# EasyEDA Pro project ProPrj_两相交错电源demo_2025-05-26.epro, board PCB5_1
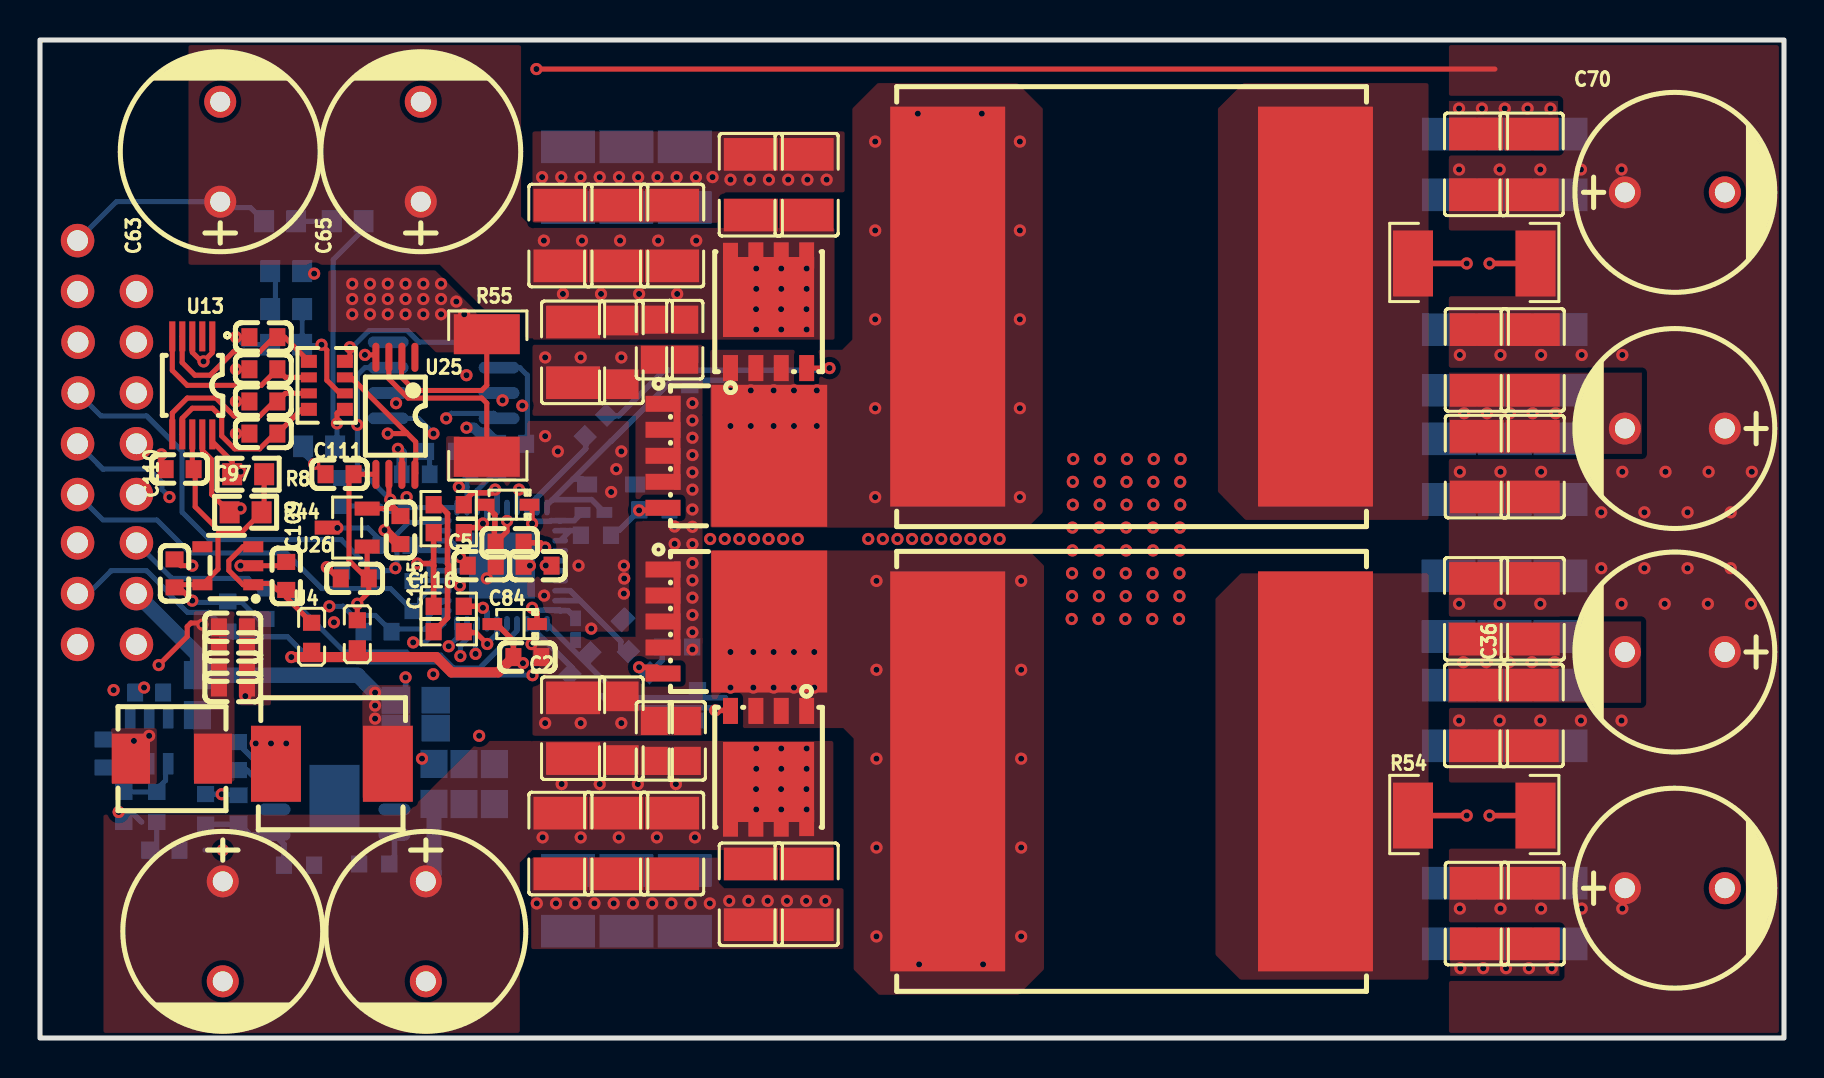
[diagram p7: board, top side]
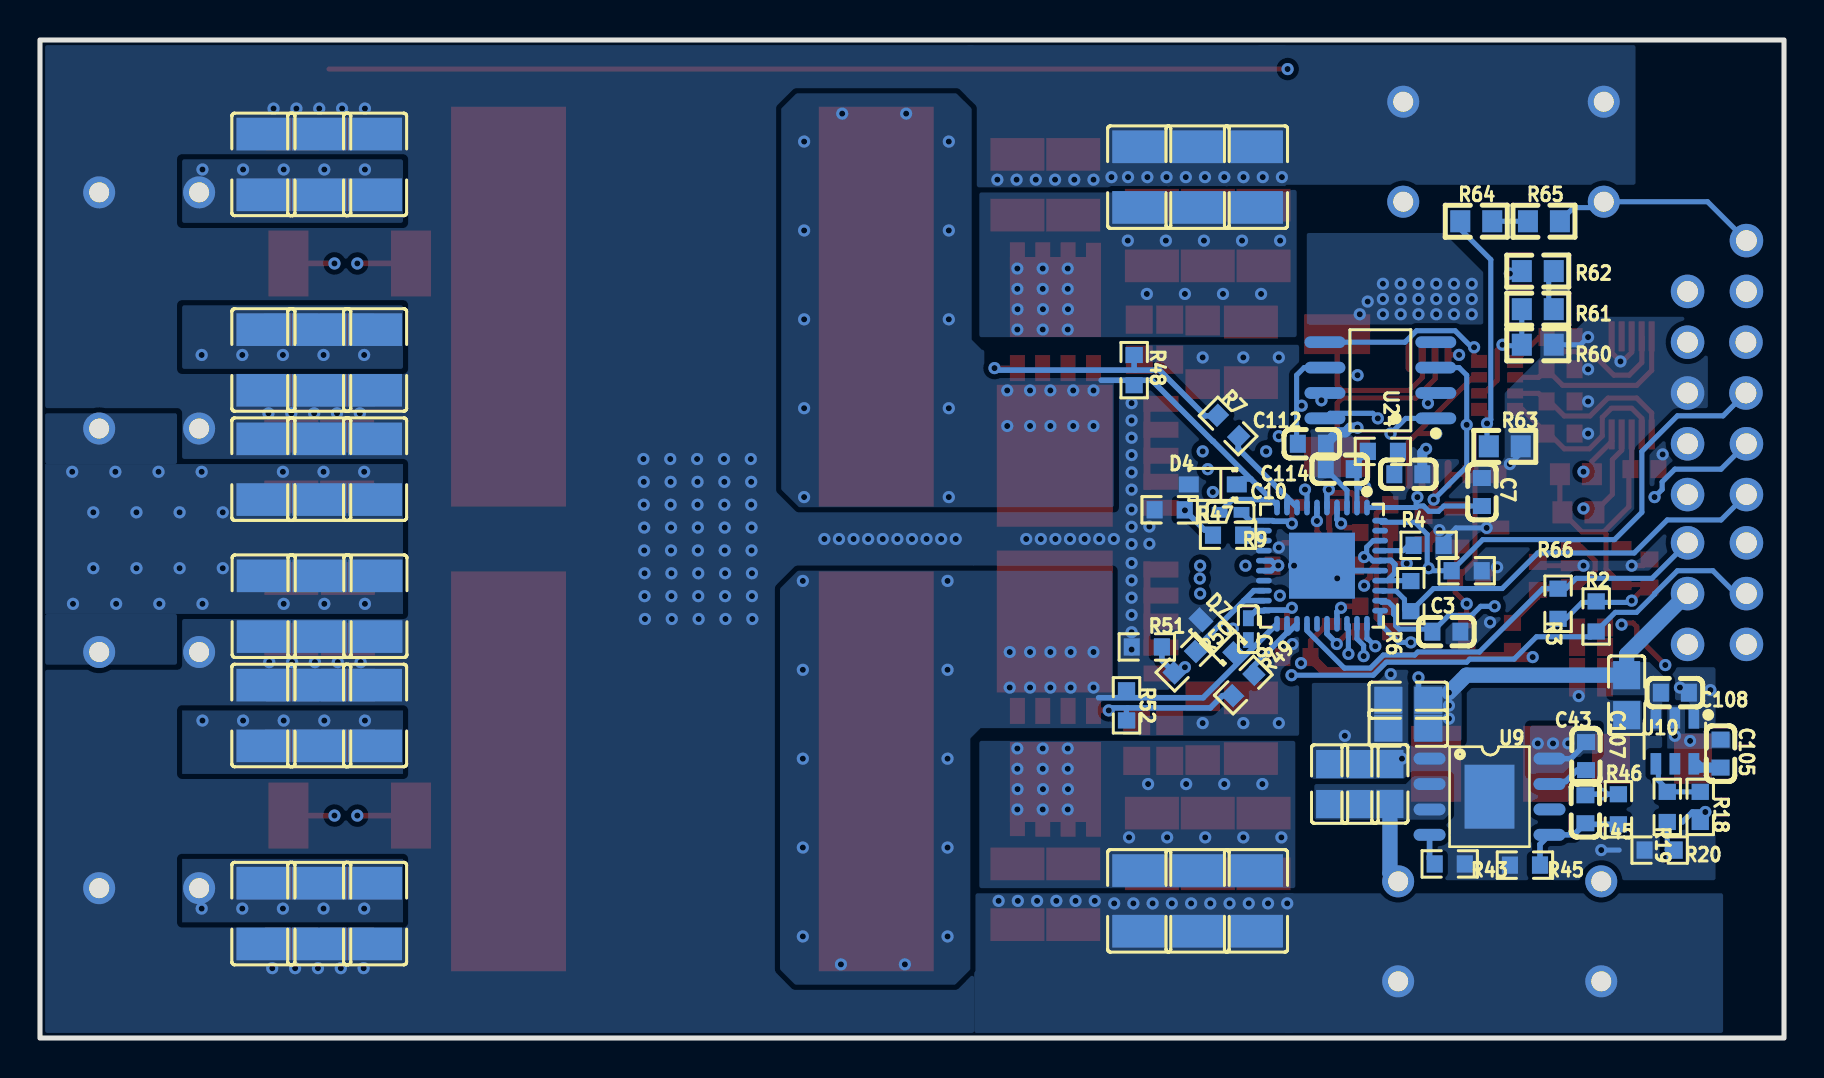
[diagram p8: board, bottom side, seen from below]

Outline 87.25 x 49.91 mm; copper layers: Top Layer, Inner1, Inner2, Bottom Layer. Coordinates in mm from the lower left corner of the outline.
Outline path: rectangle 0,49.91 87.25,0
Stack: Top Layer 0.035mm 外层铜厚1oz / Dielectric1 0.2104mm 7628 RC49% 8.6mil / Inner1 0.0152mm 内层铜厚 / Dielectric2 1.065mm 1.1mm H/HOZ Copper / Inner2 0.0152mm 内层铜厚 / Dielectric3 0.2104mm 7628 RC49% 8.6mil / Bottom Layer 0.035mm 外层铜厚1oz

## Design rules (mm)
template: 自定义配置
spacing copperThickness1oz (default): track to track 0.102, other pairs 0.152 to 0.3
spacing copperThickness2oz: track to track 0.203, other pairs 0.152 to 0.3
track width copperThickness1oz (default): min 0.127, default 0.254, max 2.54
track width copperThickness2oz: min 0.203, default 0.254, max 2.54
differential pair differentialPair (default): width min 0.127, default 0.254, max 2.54; gap min 0.152, default 0.152
via viaSize (default): diameter min 0.5, default 0.61, max 10; hole min 0.3, default 0.305, max 6.3

## Placement (name value [footprint] x y rotation side)
C2  1uF  [C0603]  24.38 19.05 0 top
C3  1uF  [C0603]  16.89 20.32 180 bottom
C5  1uF  [C0603]  22.1 23.62 0 top
C7  1uF  [C0603]  15.11 27.3 90 bottom
C8  220nF  [C0402]  26.8 20.45 270 bottom
C9  100nF  [C1210]  29.34 6.86 90 bottom
C10  220nF  [C0402]  27.69 26.29 180 bottom
C11  1uF  [C0603]  24.89 23.62 0 top
C14  100nF  [C1210]  26.03 40.13 270 top
C15  22uF  [C0805]  18.8 16.89 180 bottom
C16  22uF  [C0805]  18.8 15.49 180 bottom
C17  100nF  [C1206]  29.08 34.29 90 top
C19  100nF  [C1210]  32.26 43.05 270 bottom
C20  100nF  [C1210]  28.83 40.13 270 top
C21  100nF  [C1210]  31.62 40.13 270 top
C22  100nF  [C1210]  26.67 34.29 90 top
C29  100nF  [C1210]  71.84 21.46 90 top
C30  100nF  [C1210]  71.88 6.22 90 top
C31  100nF  [C1210]  74.68 6.22 90 top
C32  100nF  [C1210]  70.49 43.69 270 bottom
C33  100nF  [C1210]  71.84 43.69 270 top
C34  100nF  [C1210]  71.84 16.13 270 top
C35  100nF  [C1210]  74.62 16.13 270 top
C36  100nF  [C1210]  74.68 21.46 90 top
C37  100nF  [C1210]  74.62 43.69 270 top
C38  100nF  [C1210]  74.68 28.58 270 top
C41  2.2uF  [C0805]  19.72 12.71 90 bottom
C43  2.2nF  [C0603]  9.91 14.1 90 bottom
C45  56pF  [C0603]  9.94 11.44 90 bottom
C49  2.2uF  [C0805]  32.26 34.92 90 top
C50  2.2uF  [C0805]  30.73 34.92 90 top
C51  2.2uF  [C0805]  30.73 14.86 270 top
C52  2.2uF  [C0805]  32.39 14.86 270 top
C56  100nF  [C1210]  35.56 42.67 270 top
C57  100nF  [C1210]  26.42 43.05 270 bottom
C58  100nF  [C1210]  38.35 42.67 270 top
C59  100nF  [C1210]  26.42 6.86 90 bottom
C60  100nF  [C1210]  32.26 6.86 90 bottom
C61  100nF  [C1210]  29.34 43.05 270 bottom
C62  100nF  [C1206]  29.08 15.49 270 top
C63  100uF  [CAP-TH_BD10.0-P5.00-D0.6-FD_2]  9.02 44.32 90 top
C65  100uF  [CAP-TH_BD10.0-P5.00-D0.6-FD_2]  19.05 44.32 90 top
C66  100uF  [CAP-TH_BD10.0-P5.00-D0.6-FD_2]  81.79 7.49 0 top
C67  100uF  [CAP-TH_BD10.0-P5.00-D0.6-FD_2]  19.3 5.33 270 top
C68  100uF  [CAP-TH_BD10.0-P5.00-D0.6-FD_2]  81.79 19.3 180 top
C69  100uF  [CAP-TH_BD10.0-P5.00-D0.6-FD_2]  81.79 30.48 180 top
C70  100uF  [CAP-TH_BD10.0-P5.00-D0.6-FD_2]  81.79 42.29 0 top
C71  100uF  [CAP-TH_BD10.0-P5.00-D0.6-FD_2]  9.14 5.33 270 top
C72  100nF  [C1210]  35.56 7.19 90 top
C73  100nF  [C1210]  38.35 7.19 90 top
C74  100nF  [C1210]  31.62 9.73 90 top
C75  100nF  [C1210]  28.83 9.73 90 top
C76  100nF  [C1210]  26.03 9.73 90 top
C77  100nF  [C1210]  26.67 15.49 270 top
C81  100nF  [C1210]  71.88 28.58 270 top
C82  100nF  [C1210]  71.88 33.91 90 top
C83  100nF  [C1210]  74.68 33.91 90 top
C84  1uF  [C0603]  23.5 24.77 0 top
C95  105/25V  [C0603#2]  11.18 30.23 0 top
C96  105/25V  [C0603#2]  11.18 31.83 0 top
C97  105/25V  [C0603#2]  6.99 28.45 0 top
C98  105/25V  [C0603#2]  11.18 35.05 0 top
C99  105/25V  [C0603#2]  11.18 33.44 0 top
C102  2.2uF  [C0805]  21.21 12.7 90 bottom
C103  2.2uF  [C0805]  22.73 12.7 90 bottom
C104  22uF  [C0603]  9.65 17.53 0 top
C105  100nF  [C0603]  3.18 14.22 270 bottom
C106  22uF  [C0603]  9.65 18.54 0 top
C107  22uF  [C0805]  7.87 17.14 270 bottom
C108  4.7uF  [C0603]  5.46 17.27 180 bottom
C109  10uF  [C0603]  12.32 23.11 90 top
C110  10uF  [C0603]  6.73 23.24 270 top
C111  1uF  [C0603]  14.99 28.19 0 top
C112  1uF  [C0603]  23.62 29.72 180 bottom
C113  1uF  [C0603]  18.8 28.19 0 bottom
C114  1uF  [C0603]  22.22 28.45 180 bottom
C115  22uF  [C0603]  18.03 25.4 270 top
C116  4.7uf  [C0603]  15.75 22.99 0 top
C119  22uF  [C0603]  9.65 20.54 0 top
C120  22uF  [C0603]  9.65 19.56 0 top
C121  100nF  [C1210]  73.28 43.69 270 bottom
C122  100nF  [C1210]  76.07 43.69 270 bottom
C123  100nF  [C1210]  70.49 16.13 270 bottom
C124  100nF  [C1210]  73.28 16.13 270 bottom
C125  100nF  [C1210]  76.07 16.13 270 bottom
C126  100nF  [C1210]  76.07 33.91 90 bottom
C127  100nF  [C1210]  73.28 33.91 90 bottom
C128  100nF  [C1210]  70.49 33.91 90 bottom
C129  100nF  [C1210]  70.49 6.22 90 bottom
C129#2  -  [C1210]  70.47 21.59 90 bottom
C130  100nF  [C1210]  76.06 21.59 90 bottom
C130#2  -  [C1210]  73.26 21.59 90 bottom
C131  100nF  [C1210]  76.07 6.22 90 bottom
C132  100nF  [C1210]  73.28 6.22 90 bottom
C133  100nF  [C1210]  76.07 28.45 270 bottom
C134  100nF  [C1210]  73.28 28.45 270 bottom
C135  100nF  [C1210]  70.49 28.45 270 bottom
D4  BAS316,115  [SOD-323_L1.8-W1.3-LS2.5-FD]  28.58 27.69 180 bottom
D5  PMEG6010CEJ  [SOD-323_L1.7-W1.3-LS2.5-RD-1]  23.75 20.7 180 top
D6  PMEG6010CEJ  [SOD-323_L1.7-W1.3-LS2.5-RD-1]  23.37 26.67 180 top
D7  BAS316,115  [SOD-323_L1.8-W1.3-LS2.5-FD]  28.32 20.07 225 bottom
L1  68uH  [IND-SMD_L7.1-W6.6-1]  14.61 13.72 0 top
L2  10uH  [IND-SMD_L5.4-W5.2_FXL0530]  6.6 13.97 0 top
NOREF  -  [Pad_e2173]  4.83 32.26 0 top
NOREF#2  -  [Pad_e2176]  4.83 24.77 0 top
NOREF#3  -  [Pad_e2203]  1.91 32.26 0 top
NOREF#4  -  [Pad_e3434]  1.88 39.88 0 top
NOREF#5  -  [Pad_e2204]  1.88 29.72 0 top
NOREF#6  -  [Pad_e2202]  1.91 34.8 0 top
NOREF#7  -  [Pad_e2206]  1.88 24.77 0 top
NOREF#8  -  [Pad_e2192]  4.83 37.34 0 top
NOREF#9  -  [Pad_e2177]  4.83 22.22 0 top
NOREF#10  -  [Pad_e2205]  1.88 27.18 0 top
NOREF#11  -  [Pad_e2207]  1.88 22.22 0 top
NOREF#12  -  [Pad_e2174]  4.83 29.72 0 top
NOREF#13  -  [Pad_e2175]  4.83 27.18 0 top
NOREF#14  -  [Pad_e2172]  4.83 34.8 0 top
NOREF#15  -  [Pad_e2208]  1.88 19.69 0 top
NOREF#16  -  [Pad_e2201]  1.88 37.34 0 top
NOREF#17  -  [Pad_e2191]  4.83 19.69 0 top
Q10  BSC026N08NS5  [PG-TDSON-8_L5.0-W6.0-P1.27-BL-EP]  36.45 36.32 0 top
Q11  IAUA250N08S5N018AUMA1  [PG-HSOF-5_L6.9-W6.7-P1.30-LS8.0-BL]  33.83 29.12 270 top
Q12  BSC026N08NS5  [PG-TDSON-8_L5.0-W6.0-P1.27-BL-EP]  36.45 13.54 180 top
Q13  IAUA250N08S5N018AUMA1  [PG-HSOF-5_L6.9-W6.7-P1.30-LS8.0-BL]  33.83 20.83 270 top
R2  22kΩ  [R0603#2]  9.4 21.08 270 bottom
R3  22kΩ  [R0603#2]  11.3 21.72 90 bottom
R4  75kΩ  [R0603#2]  17.78 24.64 180 bottom
R6  10kΩ  [R0603#2]  18.67 22.1 90 bottom
R7  4.7Ω  [R0603#2]  27.81 30.61 45 bottom
R8  5.1K  [R0603]  10.41 28.19 0 top
R9  4.7Ω  [R0603#2]  27.81 25.15 0 bottom
R18  100K  [R0603#2]  4.19 11.56 270 bottom
R19  12K  [R0603#2]  5.84 11.56 90 bottom
R20  1.5K  [R0603#2]  6.22 9.4 180 bottom
R43  100kΩ  [R0603#2]  16.72 8.71 0 bottom
R44  5.1K  [R0603]  10.29 26.29 0 top
R45  43kΩ  [R0603#2]  12.96 8.65 180 bottom
R46  390kΩ  [R0603#2]  8.29 11.44 90 bottom
R47  100kΩ  [R0603#2]  30.73 26.42 0 bottom
R48  100kΩ  [R0603#2]  32.51 33.4 270 bottom
R49  4.7Ω  [R0603#2]  27.05 17.65 315 bottom
R50  4.7Ω  [R0603#2]  29.97 18.8 315 bottom
R51  100kΩ  [R0603#2]  31.88 19.56 0 bottom
R52  100kΩ  [R0603#2]  32.89 16.64 90 bottom
R53  10mΩ  [RES-SMD_L6.4-W3.2-R2512]  71.75 38.73 0 top
R54  10mΩ  [RES-SMD_L6.4-W3.2-R2512]  71.75 11.12 0 top
R55  10mΩ  [RES-SMD_L6.4-W3.2-R2512]  22.35 32.13 270 top
R56  47Ω  [R0603#2]  20.45 21.59 0 top
R57  47Ω  [R0603#2]  20.45 26.67 0 top
R58  47Ω  [R0603#2]  20.45 20.32 0 top
R59  47Ω  [R0603#2]  20.45 25.27 0 top
R60  2K/0.1%  [R0603]  12.32 34.67 0 bottom
R61  20K/0.1%  [R0603]  12.32 36.45 180 bottom
R62  20K/0.1%  [R0603]  12.32 38.35 0 bottom
R63  2K/0.1%  [R0603]  13.97 29.59 0 bottom
R64  20K/0.1%  [R0603]  15.4 40.85 180 bottom
R65  20K/0.1%  [R0603]  12.01 40.85 180 bottom
R66  100k  [R0603#2]  15.88 23.37 0 bottom
R67  10kΩ  [R0603#2]  20.07 29.34 180 bottom
RN2  5.1K  [RES-ARRAY-SMD_0603-8P-L3.2-W1.6-BL]  14.35 32.64 90 top
U4  -  [SOT-23-5_L3.0-W1.7-P0.95-LS2.8-TL]  9.4 23.62 180 top
U9  -  [SO-8_L4.9-W3.9-P1.27-LS6.0-BL-EP]  14.73 12.07 270 bottom
U10  TPS54302DDCR  [SOT-23-6_L2.9-W1.6-P0.95-LS2.8-BL]  5.46 14.86 0 bottom
U13  SGM58031  [MSOP-10_L3.0-W3.0-P0.50-LS5.0-BR]  7.62 32.64 90 top
U19  LM5143QRWGRQ1  [VQFN-40_L6.0-W6.0-P0.50-TL-EP3.3]  23.11 23.62 270 bottom
U22  4.7uH  [IND-SMD_L23.5-W22.0]  54.61 36.58 0 top
U23  4.7uH  [IND-SMD_L23.5-W22.0]  54.61 13.33 0 top
U24  INA240A2DR  [SOIC-8_L4.9-W3.9-P1.27-LS6.0-BL]  20.19 32.89 90 bottom
U25  INA240A1PWR  [TSSOP-8_L4.4-W3.0-P0.65-LS6.4-BL]  17.78 31.11 180 top
U26  REF3033AIDBZT  [SOT-23-3_L2.9-W1.3-P1.90-LS2.4-BR]  15.37 25.53 0 top
U27  磁珠60Ω±25%@100MHz/3A/0603  [L0603]  13.59 20.07 90 top
U28  磁珠60Ω±25%@100MHz/3A/0603  [L0603]  15.88 20.19 90 top

## Footprints (pads in the part's own frame, mm; a bottom-side part is the same pattern mirrored in y, then rotated)
C0402
  rect 0.79x0.54 smd: 1(-0.545,0) 2(0.545,0)
C0603
  rect 0.8x0.9 smd: 1(-0.7,0) 2(0.7,0)
C0603#2
  custom 0.8x0.9 smd: 1(-0.7,0) 2(0.7,0)
C0805
  rect 1.41x1.35 smd: 1(-1,0) 2(1,0)
C1206
  rect 1.485x1.728 smd: 1(-1.593,0) 2(1.593,0)
C1210
  rect 1.635x2.7 smd: 1(-1.518,0) 2(1.518,0)
CAP-TH_BD10.0-P5.00-D0.6-FD_2
  round 1.6 hole 1: 1(-2.5,0) 2(2.5,0)
IND-SMD_L5.4-W5.2_FXL0530
  rect 1.9x2.5 smd: 1(-2.05,0) 2(2.05,0)
IND-SMD_L7.1-W6.6-1
  rect 2.5x3.8 smd: 1(-2.8,0) 2(2.8,0)
IND-SMD_L23.5-W22.0
  rect 5.75x20 smd: 1(-9.2,0) 2(9.2,0)
L0603
  rect 0.8x0.864 smd: 1(-0.7,0) 2(0.7,0)
MSOP-10_L3.0-W3.0-P0.50-LS5.0-BR
  rect 1.5x0.305 smd: 1(2.451,-1) 2(2.451,-0.5) 3(2.451,0) 4(2.451,0.5) 5(2.451,1) 6(-2.451,1) 7(-2.451,0.5) 8(-2.451,0) 9(-2.451,-0.5) 10(-2.451,-1)
Pad_e2172
  round 1.677 hole 1.042: IIN(0,0)
Pad_e2173
  round 1.677 hole 1.042: 1(0,0)
Pad_e2174
  round 1.677 hole 1.042: 1(0,0)
Pad_e2175
  round 1.677 hole 1.042: 1(0,0)
Pad_e2176
  round 1.677 hole 1.042: 1(0,0)
Pad_e2177
  round 1.677 hole 1.042: 1(0,0)
Pad_e2191
  round 1.677 hole 1.042: 1(0,0)
Pad_e2192
  round 1.677 hole 1.042: 1(0,0)
Pad_e2201
  round 1.677 hole 1.042: 1(0,0)
Pad_e2202
  round 1.677 hole 1.042: 1(0,0)
Pad_e2203
  round 1.677 hole 1.042: 1(0,0)
Pad_e2204
  round 1.677 hole 1.042: 1(0,0)
Pad_e2205
  round 1.677 hole 1.042: 1(0,0)
Pad_e2206
  round 1.677 hole 1.042: 1(0,0)
Pad_e2207
  round 1.677 hole 1.042: 1(0,0)
Pad_e2208
  round 1.677 hole 1.042: 1(0,0)
Pad_e3434
  round 1.677 hole 1.042: 1(0,0)
PG-HSOF-5_L6.9-W6.7-P1.30-LS8.0-BL
  rect 0.8x1.75 smd: 1(-2.6,-2.658) 2(-1.3,-2.658) 3(0,-2.658) 4(1.3,-2.658) 5(2.6,-2.658)
  rect 4.7x0.35 smd: 1(-0.65,-1.958)
  rect 7.1x5.8 smd: 6(0,2.658)
PG-TDSON-8_L5.0-W6.0-P1.27-BL-EP
  rect 0.75x1.3 smd: 1(-1.905,-2.82) 2(-0.635,-2.82) 3(0.635,-2.82) 4(1.905,-2.82) 5(1.905,2.82) 6(0.635,2.82) 7(-0.635,2.82) 8(-1.905,2.794)
  rect 4.56x4 smd: 8(0,0.737)
R0603
  rect 1x1.1 smd: 1(-0.8,0) 2(0.8,0)
R0603#2
  rect 0.806x0.864 smd: 1(-0.753,0) 2(0.753,0)
RES-ARRAY-SMD_0603-8P-L3.2-W1.6-BL
  rect 0.65x0.8 smd: 1(-1.2,-0.9) 4(1.2,-0.9) 5(1.2,0.9) 8(-1.2,0.9)
  rect 0.5x0.8 smd: 2(-0.4,-0.9) 3(0.4,-0.9) 6(0.4,0.9) 7(-0.4,0.9)
RES-SMD_L6.4-W3.2-R2512
  rect 2x3.3 smd: 1(-3.067,0) 2(3.067,0)
SO-8_L4.9-W3.9-P1.27-LS6.0-BL-EP
  oval 0.6x1.6 smd: 1(-1.905,-2.999) 2(-0.635,-2.999) 3(0.635,-2.999) 4(1.905,-2.999) 5(1.905,2.999) 6(0.635,2.999) 7(-0.635,2.999) 8(-1.905,2.999)
  rect 3.2x2.499 smd: 9(0,0)
SOD-323_L1.7-W1.3-LS2.5-RD-1
  rect 0.985x0.6 smd: 1(-1.117,0) 2(1.117,0)
SOD-323_L1.8-W1.3-LS2.5-FD
  rect 1x0.8 smd: 1(-1.2,0) 2(1.2,0)
SOIC-8_L4.9-W3.9-P1.27-LS6.0-BL
  oval 0.588x2.045 smd: 1(-1.905,-2.772) 2(-0.635,-2.772) 3(0.635,-2.772) 4(1.905,-2.772) 5(1.905,2.772) 6(0.635,2.772) 7(-0.635,2.772) 8(-1.905,2.772)
SOT-23-3_L2.9-W1.3-P1.90-LS2.4-BR
  rect 1.25x0.7 smd: 1(1,-0.95) 2(1,0.95) 3(-1,0)
SOT-23-5_L3.0-W1.7-P0.95-LS2.8-TL
  rect 1.001x0.551 smd: 1(-1.272,0.95) 2(-1.272,0) 3(-1.272,-0.95) 4(1.272,-0.95) 5(1.272,0.95)
SOT-23-6_L2.9-W1.6-P0.95-LS2.8-BL
  rect 0.532x1.072 smd: 1(-0.95,-1.149) 2(0,-1.149) 3(0.95,-1.149) 4(0.95,1.149) 5(0,1.149) 6(-0.95,1.149)
TSSOP-8_L4.4-W3.0-P0.65-LS6.4-BL
  oval 0.353x1.454 smd: 1(-0.975,-2.927) 2(-0.325,-2.927) 3(0.325,-2.927) 4(0.975,-2.927) 5(0.975,2.927) 6(0.325,2.927) 7(-0.325,2.927) 8(-0.975,2.927)
VQFN-40_L6.0-W6.0-P0.50-TL-EP3.3
  oval 0.79x0.28 smd: 1(-2.908,2.25) 2(-2.908,1.75) 3(-2.908,1.25) 4(-2.908,0.75) 5(-2.908,0.25) 6(-2.908,-0.25) 7(-2.908,-0.75) 8(-2.908,-1.25) 9(-2.908,-1.75) 10(-2.908,-2.25) 21(2.908,-2.25) 22(2.908,-1.75) 23(2.908,-1.25) 24(2.908,-0.75) 25(2.908,-0.25) 26(2.908,0.25) 27(2.908,0.75) 28(2.908,1.25) 29(2.908,1.75) 30(2.908,2.25)
  oval 0.28x0.79 smd: 11(-2.25,-2.908) 12(-1.75,-2.908) 13(-1.25,-2.908) 14(-0.75,-2.908) 15(-0.25,-2.908) 16(0.25,-2.908) 17(0.75,-2.908) 18(1.25,-2.908) 19(1.75,-2.908) 20(2.25,-2.908) 31(2.25,2.908) 32(1.75,2.908) 33(1.25,2.908) 34(0.75,2.908) 35(0.25,2.908) 36(-0.25,2.908) 37(-0.75,2.908) 38(-1.25,2.908) 39(-1.75,2.908) 40(-2.25,2.908)
  rect 3.3x3.3 smd: 41(0,0)

## Nets
12V: C15.2 C16.2 C45.2 C107.1 C108.1 L1.2 NOREF#9.1 R46.2 U10.3
+3.3V: C97.2 C110.2 R2.1 R3.1 R8.2 R44.2 U4.5 U13.8
+5V: C2.1 C84.1 C104.1 C106.1 C109.1 C111.2 C112.1 C116.2 C119.1 C120.1 D5.2 D6.2 L2.2 NOREF#17.1 R18.2 U4.1 U4.3 U19.6 U24.6 U25.5 U26.1 U27.1 U27.2 U28.1 U28.2
GND: C2.2 C3.2 C5.2 C7.2 C9.1 C11.1 C14.1 C15.1 C16.1 C17.1 C19.1 C20.1 C21.1 C22.1 C29.1 C30.1 C31.1 C32.1 C33.1 C34.1 C35.1 C36.1 C37.1 C38.1 C41.2 C49.1 C50.1 C51.1 C52.1 C56.1 C57.1 C58.1 C59.1 C60.1 C61.1 C62.1 C63.2 C65.2 C66.2 C67.2 C68.2 C69.2 C70.2 C71.2 C72.1 C73.1 C74.1 C75.1 C76.1 C77.1 C81.1 C82.1 C83.1 C84.2 C95.1 C96.1 C97.1 C98.1 C99.1 C102.2 C103.2 C104.2 C106.2 C107.2 C108.2 C109.2 C110.1 C111.1 C112.2 C113.1 C114.1 C115.2 C116.1 C119.2 C120.2 C121.1 C122.1 C123.1 C124.1 C125.1 C126.1 C127.1 C128.1 C129.1 C129#2.1 C130.1 C130#2.1 C131.1 C132.1 C133.1 C134.1 C135.1 D4.1 D7.1 NOREF.1 NOREF#15.1 Q11.1 Q11.2 Q11.3 Q11.4 Q13.1 Q13.2 Q13.3 Q13.4 R4.2 R20.1 R43.1 R45.1 R47.2 R51.2 R60.1 R63.1 R66.1 U4.2 U9.1 U9.9 U10.1 U13.1 U13.3 U19.3 U19.14 U19.17 U19.35 U19.41 U24.2 U24.7 U25.4 U25.7 U26.3
VCC: C9.2 C14.2 C17.2 C19.2 C20.2 C21.2 C22.2 C41.1 C49.2 C50.2 C51.2 C52.2 C56.2 C57.2 C58.2 C59.2 C60.2 C61.2 C62.2 C63.1 C65.1 C67.1 C71.1 C72.2 C73.2 C74.2 C75.2 C76.2 C77.2 C102.1 C103.1 NOREF#4.1 Q10.5 Q10.6 Q10.7 Q10.8 Q12.5 Q12.6 Q12.7 Q12.8 R55.2 R65.2 U9.2 U9.3 U25.3
VIN: R55.1 U25.2
VINS: R63.2 R64.1 RN2.1
COMP: C114.2 R67.1 U19.2 U19.29
CS1: R54.1 R56.2 U19.27 U23.2
CS2: R53.1 R59.2 U19.4 U22.2
DEMB: NOREF#10.1 R6.1 U19.33
EN: NOREF#3.1 R66.2 U19.31 U19.40
FB: NOREF#13.1 U19.28
H1: R49.1 U19.22 U19.23
H2: R7.1 U19.8 U19.9
IIC_SCL: NOREF#12.1 R8.1 U13.10
IIC_SDA: NOREF#5.1 R44.1 U13.9
IIN: NOREF#14.IIN RN2.3 U25.8
IOUT: NOREF#16.1 RN2.4 U24.5
L1: R50.1 U19.18 U19.19
L2: R9.1 U19.12 U19.13
PG1: NOREF#2.1 R3.2 U19.24
PG2: NOREF#11.1 R2.2 U19.7
REF: C115.1 NOREF#6.1 U24.3 U25.6 U26.2
RES: C3.1 NOREF#7.1 U19.32
SW1: C8.2 D7.2 Q12.1 Q12.2 Q12.3 Q13.6 R52.2 U19.21 U23.1
SW2: C10.1 D4.2 Q10.1 Q10.2 Q10.3 Q11.6 R48.2 U19.10 U22.1
VOUT: C29.2 C30.2 C31.2 C32.2 C33.2 C34.2 C35.2 C36.2 C37.2 C38.2 C66.1 C68.1 C69.1 C70.1 C81.2 C82.2 C83.2 C121.2 C122.2 C123.2 C124.2 C125.2 C126.2 C127.2 C128.2 C129.2 C129#2.2 C130.2 C130#2.2 C131.2 C132.2 C133.2 C134.2 C135.2 NOREF#8.1 R53.2 R54.2 R57.2 R58.2 R62.2 U19.5 U19.26
VOUTS: R60.2 R61.1 RN2.2
$1N920: C11.2 U19.15 U19.16
$1N1636: C7.1 U19.1 U19.30
$1N1751: R4.1 U19.37
$1N1787: C5.1 R6.2 U19.34 U19.36 U19.38
$1N4968: Q10.4 R7.2 R48.1
$1N4976: Q11.5 R9.2 R47.1
$1N5499: C8.1 D5.1 U19.20
$1N5574: C10.2 D6.1 U19.11
$1N7681: R43.2 U9.4
$1N7684: C43.2 L1.1 U9.8
$1N7685: C43.1 U9.7
$1N7687: C45.1 R45.2 R46.1 U9.5
$1N8268: Q12.4 R49.2 R52.1
$1N8274: Q13.5 R50.2 R51.1
$1N24788: R57.1 R58.1 U24.8
$1N24792: R56.1 R59.1 U24.1
$1N25603: C99.2 RN2.6 U13.5
$1N25604: C95.2 RN2.8 U13.7
$1N25605: C96.2 RN2.7 U13.6
$1N25606: C98.2 RN2.5 U13.4
$1N32854: C105.1 L2.1 U10.2
$1N32855: C105.2 U10.6
$1N32858: R19.1 R20.2
$1N32864: R18.1 R19.2 U10.4
$1N33061: R61.2 R62.1
$1N33196: R64.2 R65.1
$1N37380: C113.2 R67.2

Pads without a net: U4 4; U9 6; U10 5; U13 2; U19 25 39; U24 4; U25 1

## Via types
v1: diameter 0.61, hole 0.305, Top Layer to Bottom Layer, 381 vias

## Routing (per net, layer and track width the routed paths; a pad name or vN(x,y) marks a point on that pad's centre or on a via; arc(x,y) is an arc through that point)
12V: length 30.9
  Inner1 w0.28: v1(18.29,18.03) 12.07,18.03 10.2,16.17 10.2,13.3 v1(9.09,12.19)
  Bottom Layer w0.28: R46.2 v1(9.09,12.19) 9.88,12.19 C45.2 ; C15.2 18.29,17.38 v1(18.29,18.03)
  Bottom Layer w0.762: v1(16.76,17.27) 15.89,18.14 C107.1 7.87,19.18 NOREF#9.1
  vias: v1(16.76,16.62) v1(16.76,15.97)
+3.3V: length 19.2
  Top Layer w0.254: 9.02,25.31 8.91,25.2 8.91,23.45 U4.5 6.86,22.67 C110.2 6.96,22.54 v1(7.62,21.87) ; 9.02,25.31 7.76,26.57 7.76,28.12 7.43,28.45 ; 9.02,25.31 10.11,25.31 R44.2 11.21,26.42 R8.2 ; U13.8 7.62,28.51
  Bottom Layer w0.254: 10.92,20.96 10.1,21.78 7.71,21.78 v1(7.62,21.87)
+5V: length 90.2
  Top Layer w0.254: U28.2 v1(15.88,21.72) 16.45,22.29 C116.2 ; C116.2 16.37,23.07 U26.1 ; C116.2 16.35,22.99 15.46,23.88 15.46,27.97 C111.2 16.8,28.19 U25.5 ; C2.1 23.86,19.05 v1(24.16,18.75) ; v1(23.37,25.86) 23.37,25.34 C84.1 ; U27.2 12.32,22.04 C109.1 11.88,22.41 11.56,22.73 10.73,22.73 U4.1 10.16,22.67 9.45,23.38 9.45,23.86 10.15,24.57 U4.3 ; v1(5.94,18.65) 7.37,20.08 7.37,20.57 7.55,20.75 8.05,20.75 v1(8.13,20.67)
  Top Layer w0.28: D5.2 22.8,20.53 23.02,20.53 23.68,19.86 C2.1 ; 22.73,25.15 22.73,25.46 22.76,25.48 22.76,26.16 D6.2
  Top Layer w0.508: v1(12.57,19.05) 19.82,19.05 20.58,18.29 22.92,18.29 C2.1
  Inner1 w0.254: v1(5.94,18.65) 5.86,18.57 3.9,18.57 2.92,17.59 2.92,13.33 3.94,12.32 v1(3.94,11.3) ; v1(21.34,33.15) 22.99,33.15 24.13,32 v1(24.13,31.62)
  Inner2 w0.254: v1(21.34,33.15) 18.54,30.35 18.54,28.96 16.08,26.49 16.08,21.92 v1(15.88,21.72)
  Inner2 w0.508: v1(24.16,18.75) 24.16,19.12 23.88,19.41 23.88,20.06 23.37,20.57 v1(23.37,25.86) ; v1(12.57,19.05) 9.75,19.05 v1(8.13,20.67) 7.77,20.67 6.78,19.69 NOREF#17.1
  Bottom Layer w0.254: U24.6 24,33.53 24.38,33.15 24.38,29.72
  Bottom Layer w0.28: v1(3.94,11.3) 4.58,11.3 5.08,10.8 ; v1(23.37,25.86) 23.37,26.53 U19.6
GND: length 34.5
  Top Layer w0.254: U13.1 8.62,34.27 v1(8.18,33.84) 8.08,33.84 7.62,34.29 U13.3 ; 10.35,31.83 9.78,31.83 ; v1(14.35,23.55) 14.91,22.99 C116.1 ; 10.35,35.05 9.78,35.05 ; C111.1 13.78,28.7 v1(13.72,28.7) ; C110.1 7.05,23.62 v1(7.62,23.62) ; C97.1 6.07,28.66 v1(6.07,29.19) ; v1(14.88,25.51) 14.38,25.51 U26.3 ; C109.2 12.13,23.62 U4.2 10.04,23.62 v1(10.03,23.62) ; v1(17.91,29.46) 18.11,29.27 U25.7 ; 10.35,33.44 9.78,33.44 ; 10.35,30.23 9.78,30.23 ; v1(16.26,34.16) 16.68,34.16 U25.4
  Top Layer w0.28: C84.2 25.04,24.77 v1(25.27,24.53)
  Top Layer w0.508: C115.2 17.94,24.7 v1(17.24,25.4)
  Inner1 w0.508: v1(9.14,9.4) 9.14,10.8 ; v1(23.14,31.89) 23,31.75 22.61,31.75
  Bottom Layer w0.254: 17.28,24.64 16.41,25.51 v1(14.88,25.51) ; R63.1 13.17,29.25 v1(13.72,28.7) ; C114.1 21.86,27.39 U19.3 ; 8.25,9.4 v1(9.14,9.4) ; R60.1 10.18,34.67 v1(9.8,35.05)
  Bottom Layer w0.28: U19.35 22.86,23.37 U19.41
  Bottom Layer w0.508: v1(21.34,30.52) 21.71,30.52 21.95,30.29 22.35,30.29 C112.2 22.93,29.71 C114.1 ; C113.1 18.1,29.27 v1(17.91,29.46)
  vias: v1(3.68,17.4) v1(5.21,17.53) v1(9.8,33.44) v1(9.8,31.83) v1(9.8,30.23) v1(10.27,17.1) v1(14.71,20.79) v1(17.81,31.75) v1(19.11,13.97) v1(19.67,18.19) v1(21.97,15.11) v1(22.35,22.99) v1(24.51,23.62) v1(24.59,19.7) v1(24.85,6.73) v1(25.12,43.05) v1(25.27,34.04) v1(25.27,15.75) v1(25.81,6.73) v1(26.08,43.05) v1(26.78,6.73) v1(27.04,43.05) v1(27.05,34.04) v1(27.05,15.75) v1(27.74,6.73) v1(28,43.05) v1(28.7,6.73) v1(28.97,43.05) v1(29.08,34.04) v1(29.08,15.75) v1(29.66,6.73) v1(29.93,43.05) v1(30.63,6.73) v1(30.89,43.05) v1(31.59,6.73) v1(31.75,25.58) v1(31.75,24.71) v1(31.85,43.05) v1(32.55,6.73) v1(32.64,31.75) v1(32.64,30.88) v1(32.64,30.02) v1(32.64,29.15) v1(32.64,28.29) v1(32.64,27.42) v1(32.64,26.43) v1(32.64,25.57) v1(32.64,24.7) v1(32.64,23.75) v1(32.64,22.89) v1(32.64,22.02) v1(32.64,21.16) v1(32.64,20.29) v1(32.64,19.43) v1(32.82,43.05) v1(33.53,24.96) v1(33.51,6.73) v1(33.65,43.05) v1(34.26,24.96) v1(34.48,6.86) v1(34.54,42.93) v1(34.99,24.96) v1(35.51,42.93) v1(35.44,6.86) v1(35.72,24.96) v1(36.4,6.86) v1(36.47,42.93) v1(36.45,24.96) v1(37.18,24.96) v1(37.37,6.86) v1(37.43,42.93) v1(37.91,24.96) v1(38.33,6.86) v1(38.39,42.93) v1(39.29,6.86) v1(39.35,42.93) v1(41.44,24.96) v1(42.17,24.96) v1(42.9,24.96) v1(43.63,24.96) v1(44.36,24.96) v1(45.09,24.96) v1(45.82,24.96) v1(46.55,24.96) v1(47.28,24.96) v1(48.01,24.96) v1(51.61,20.95) v1(51.69,28.96) v1(51.67,27.81) v1(51.67,26.67) v1(51.65,25.53) v1(51.65,24.38) v1(51.63,23.24) v1(51.63,22.1) v1(53.01,27.81) v1(53.01,26.67) v1(52.99,25.53) v1(52.99,24.38) v1(52.97,23.24) v1(52.97,22.1) v1(52.96,20.95) v1(53.03,28.96) v1(54.32,23.24) v1(54.32,22.1) v1(54.3,20.95) v1(54.38,28.96) v1(54.36,27.81) v1(54.36,26.67) v1(54.34,25.53) v1(54.34,24.38) v1(55.72,28.96) v1(55.7,27.81) v1(55.7,26.67) v1(55.68,25.53) v1(55.68,24.38) v1(55.66,23.24) v1(55.66,22.1) v1(55.64,20.95) v1(57.02,25.53) v1(57.02,24.38) v1(57,23.24) v1(57,22.1) v1(56.98,20.95) v1(57.06,28.96) v1(57.04,27.81) v1(57.04,26.67) v1(70.99,46.48) v1(71.06,3.49) v1(71.21,18.8) v1(71.25,31.24) v1(72.14,46.48) v1(72.2,3.49) v1(72.39,31.24) v1(72.35,18.8) v1(73.28,46.48) v1(73.34,3.49) v1(73.49,18.8) v1(73.53,31.24) v1(74.42,46.48) v1(74.49,3.49) v1(74.68,31.24) v1(74.64,18.8) v1(75.56,46.48) v1(75.63,3.49) v1(75.82,31.24) v1(75.78,18.8)
VCC: length 24.3
  Top Layer w0.254: 17.46,34.04 17.46,32.96 18.42,32 22.1,32 22.35,31.75 R55.2
  Bottom Layer w0.254: R65.2 10.53,41.53 8.72,41.53 C63.1 3.83,41.82 NOREF#4.1
  Bottom Layer w0.762: C67.1 19.72,8.25 C41.1
  vias: v1(25.21,39.88) v1(25.22,22.12) v1(25.15,10.03) v1(25.27,30.1) v1(25.91,29.34) v1(26.1,12.7) v1(26.16,37.21) v1(26.94,23.62) v1(27.11,39.88) v1(27.05,10.03) v1(27.58,20.47) v1(28,12.7) v1(28.07,37.21) v1(28.58,27.3) v1(28.83,28.45) v1(29.02,39.88) v1(28.96,10.03) v1(29.08,29.34) v1(29.21,23.62) v1(29.23,22.98) v1(29.21,22.22) v1(29.91,12.7) v1(29.97,37.21) v1(30.92,39.88) v1(30.86,10.03) v1(31.81,12.7) v1(31.88,37.21) v1(32.83,39.88) v1(32.77,10.03) v1(35.82,36.45) v1(35.82,12.45) v1(35.83,38.48) v1(35.83,37.46) v1(35.83,35.43) v1(35.83,14.48) v1(35.83,13.46) v1(35.83,11.43) v1(37.08,38.48) v1(37.08,37.46) v1(37.08,36.45) v1(37.08,35.43) v1(37.08,14.48) v1(37.08,13.46) v1(37.07,12.45) v1(37.08,11.43) v1(38.35,38.48) v1(38.35,37.46) v1(38.34,36.45) v1(38.35,35.43) v1(38.35,14.48) v1(38.35,13.46) v1(38.34,12.45) v1(38.35,11.43)
VIN: length 8.1
  Top Layer w0.254: U25.2 18.09,34.02 18.09,33.04 18.74,32.38 22.1,32.38 22.35,32.64 22.35,35.07
  vias: v1(15.62,37.72) v1(15.62,36.96) v1(15.62,36.19) v1(16.51,37.72) v1(16.51,36.96) v1(16.51,36.19) v1(17.4,37.72) v1(17.4,36.96) v1(17.4,36.19) v1(18.29,37.72) v1(18.29,36.96) v1(18.29,36.19) v1(19.18,37.72) v1(19.18,36.96) v1(19.18,36.19) v1(20.07,37.72) v1(20.07,36.96) v1(20.07,36.19) v1(20.83,36.83) v1(21.22,36.19)
VINS: length 13.3
  Top Layer w0.254: v1(14.86,30.73) 14.86,31.24 15.01,31.4 15.51,31.4
  Bottom Layer w0.254: R64.1 16.26,40.78 16.26,40.52 14.67,38.93 14.67,30.92 v1(14.86,30.73) 14.86,29.68 R63.2
COMP: length 14.4
  Inner2 w0.254: v1(21.03,19.1) 21.03,21.54 21.72,22.22 21.72,24.77 20.96,25.53 v1(20.96,27.56)
  Bottom Layer w0.254: 21.36,27.55 21.36,28.16 21.53,28.32 21.53,28.63 R67.1 ; 21.36,27.55 21.35,27.56 v1(20.96,27.56) ; 21.36,27.55 U19.2 ; U19.29 21.36,19.97 21.03,19.63 v1(21.03,19.1)
CS1: length 78.4
  Top Layer w0.28: R56.2 22.09,21.59 v1(22.16,21.52) ; R54.1 v1(71.37,11.12)
  Inner2 w0.28: 71.32,11.12 69.72,9.52 69.72,2.67 68.58,1.52 27.81,1.52 23.37,5.97 23.37,19.56 22.16,20.77 v1(22.16,21.52)
  Bottom Layer w0.28: v1(22.16,21.52) 22.36,21.31 U19.27
CS2: length 83
  Top Layer w0.28: v1(22.16,25.73) 21.96,25.53 21.07,25.53 ; R53.1 v1(71.37,38.73)
  Inner2 w0.28: v1(22.16,25.73) 22.3,25.73 23.37,26.8 23.37,29.86 22.54,30.69 22.54,44.01 26.99,48.46 69.02,48.46 69.47,48.01 69.47,40.64 v1(71.37,38.73)
  Bottom Layer w0.28: U19.4 22.36,25.93 v1(22.16,25.73)
DEMB: length 21.5
  Bottom Layer w0.254: U19.33 20.08,22.37 20.06,22.35 19.4,22.35 18.99,21.94 18.99,21.41 18.92,21.34 R6.1 17.53,22.48 14.1,22.48 12.32,24.26 7.49,24.26 5.84,25.91 3.15,25.91 NOREF#10.1
EN: length 32.4
  Inner2 w0.254: v1(18.67,19.78) 18.67,22.61 v1(17.78,23.49)
  Bottom Layer w0.254: NOREF#3.1 3.05,31.11 5.33,31.11 7.11,29.34 7.11,26.29 8.48,24.93 15.07,24.93 R66.2 17.65,23.37 v1(17.78,23.49) 17.83,23.49 17.85,23.52 17.85,25.19 18.46,25.79 20.13,25.79 U19.40 ; v1(18.67,19.78) 19.27,19.78 20.21,20.72 U19.31
FB: length 24.5
  Inner2 w0.254: NOREF#13.1 7.37,24.64 14.61,24.64 15.55,23.7 15.55,22.21 15.29,21.96 15.29,21.16 17.65,18.8 20.38,18.8 20.79,18.39 21.27,18.39 21.62,18.73 21.62,18.91 21.79,19.08 v1(21.79,19.21)
  Bottom Layer w0.254: v1(21.79,19.21) 21.79,20.64 U19.28
H1: length 4
  Bottom Layer w0.28: 24.86,20.27 26.63,18.5 26.63,18.42 26.39,18.19 ; 24.86,20.27 U19.22 ; 24.86,20.27 24.81,20.27 U19.23
H2: length 5.1
  Bottom Layer w0.28: 24.86,27.04 24.36,26.53 ; 24.86,27.04 27.31,29.48 27.31,29.87 ; 24.86,27.04 U19.9
IIC_SCL: length 8.6
  Top Layer w0.254: R8.1 9.61,28.83 8.62,29.83 U13.10
  Inner2 w0.254: NOREF#12.1 4.83,28.96 5.46,28.32 v1(10.03,28.32)
IIC_SDA: length 14.2
  Top Layer w0.254: R44.1 8.59,27.19 8.59,28.92 8.12,29.39 U13.9
  Inner2 w0.254: v1(10.03,26.48) 7.05,26.48 v1(6.48,27.05)
  Bottom Layer w0.254: v1(6.48,27.05) 6.1,27.43 6.1,27.81 5.46,28.45 3.15,28.45 NOREF#5.1
IIN: length 21.7
  Top Layer w0.254: 18.76,28.19 18.8,28.23 18.8,29.81 18.33,30.28 ; 18.33,30.28 15.61,33 15.51,33 ; 18.33,30.28 18.28,30.23 v1(17.4,30.23)
  Inner2 w0.254: v1(17.4,30.23) 17.27,30.23 14.95,32.55 7.08,32.55 NOREF#14.IIN
IOUT: length 23.6
  Top Layer w0.254: 15.51,33.8 v1(15.51,34.54)
  Inner2 w0.254: NOREF#16.1 1.88,37.24 3.05,36.07 13.98,36.07 v1(15.51,34.54)
  Bottom Layer w0.254: v1(15.51,34.54) 15.63,34.54 16.45,35.37 18.39,35.37 18.96,34.8 U24.5
L1: length 5.5
  Bottom Layer w0.28: U19.19 27.02,21.87 ; 27.02,21.87 29.06,19.84 29.06,19.46 ; 27.02,21.87 26.52,22.37 U19.18
L2: length 1.8
  Bottom Layer w0.28: 27.06,25.27 26.96,25.37 26.52,25.37 ; 26.52,25.37 26.02,24.87 ; 26.52,25.37 U19.12
PG1: length 22.8
  Bottom Layer w0.254: NOREF#2.1 6.6,22.99 10.41,22.99 10.92,22.47 12.07,22.47 15.24,19.3 18.32,19.3 18.48,19.15 20.04,19.15 20.7,18.5 22,18.5 23.86,20.37 U19.24
PG2: length 36.5
  Inner2 w0.254: v1(24.64,18.14) 24.77,18.27 24.77,19.05 25.17,19.46 25.17,19.94 24.77,20.35 24.77,20.45 23.88,21.34 23.88,22.48 23.96,22.57 23.96,23.34 23.93,23.38 23.93,23.86 23.96,23.9 v1(23.96,27.43)
  Bottom Layer w0.254: v1(23.96,27.43) 23.86,27.33 U19.7 ; v1(24.64,18.14) 20.55,18.14 19.9,18.8 15.88,18.8 15.72,18.95 13.5,18.95 12.38,20.07 9.66,20.07 R2.2 8.44,21.29 7.38,21.29 6.48,22.19 6.48,22.22 5.33,23.37 3.56,23.37 2.41,22.22 NOREF#11.1
REF: length 28.9
  Top Layer w0.254: 16.37,26.48 17.78,26.48 ; 17.78,26.48 18.03,26.23 18.03,26.23 ; 17.78,26.48 17.46,26.8 17.46,28.19
  Inner2 w0.254: v1(15.88,30.66) 15.22,31.32 14.62,31.32 14.44,31.14 4.17,31.14 3.42,31.89 3.42,33.28 NOREF#6.1
  Bottom Layer w0.254: v1(17.53,26.92) 15.88,28.58 v1(15.88,30.66) 15.88,33.15 16.26,33.53 U24.3
RES: length 21
  Inner2 w0.254: v1(14.48,21.59) 9.14,21.59 7.7,23.04 6.05,23.04 5.59,23.49 3.15,23.49 NOREF#7.1
  Bottom Layer w0.254: 17.78,20.45 19.25,20.45 19.43,20.63 19.43,21.1 19.53,21.2 19.53,21.55 19.78,21.79 20.13,21.79 U19.32 ; C3.1 16.78,21.13 15.63,21.13 15.18,21.59 v1(14.48,21.59)
SW1: length 10.5
  Bottom Layer w0.28: 34.29,17.02 29.06,17.02 U19.21
  vias: v1(34.54,19.3) v1(34.54,17.53) v1(35.69,19.3) v1(35.69,17.53) v1(36.7,19.3) v1(36.7,17.53) v1(37.72,19.3) v1(37.72,17.53) v1(38.74,19.3) v1(38.74,17.53) v1(41.85,22.86) v1(41.85,18.41) v1(41.85,13.97) v1(41.85,9.52) v1(41.85,5.08) v1(43.98,3.68) v1(47.18,3.68) v1(49.09,22.86) v1(49.09,18.41) v1(49.09,13.97) v1(49.09,9.52) v1(49.09,5.08)
SW2: length 15.2
  Bottom Layer w0.28: 34.16,32.89 31.62,32.89 28.58,29.84 28.56,29.84 26.68,27.96 ; 25.64,26.92 27.6,26.92 C10.1 ; 25.64,26.92 25.36,26.65 U19.10 ; 25.64,26.92 26.68,27.96 ; 26.68,27.96 27.1,27.96 D4.2
  vias: v1(34.54,32.38) v1(34.54,30.61) v1(35.56,32.38) v1(35.56,30.61) v1(36.7,32.38) v1(36.7,30.61) v1(37.72,32.38) v1(37.72,30.61) v1(38.86,32.38) v1(38.86,30.61) v1(41.78,44.83) v1(41.78,40.39) v1(41.78,35.94) v1(41.78,31.5) v1(41.78,27.05) v1(43.92,46.23) v1(47.12,46.23) v1(49.02,44.83) v1(49.02,40.39) v1(49.02,35.94) v1(49.02,31.5) v1(49.02,27.05)
VOUT: length 236.5
  Top Layer w0.254: 72.78,48.46 v1(24.84,48.46) ; R58.2 21.55,20.32 21.61,20.27 21.81,20.27 v1(22.38,19.7)
  Top Layer w0.28: R53.2 v1(72.52,38.73) ; 21.07,26.92 21.3,26.92 21.64,27.26 22.61,27.26 v1(22.77,27.43) ; R54.2 72.39,11.12
  Inner2 w0.254: 13.84,38.3 14.66,39.12 18.8,39.12 20.96,41.27 20.96,44.58 v1(24.84,48.46) ; v1(13.72,38.23) 5.72,38.23 NOREF.1
  Inner2 w0.28: v1(72.52,38.73) 69.98,41.27 69.98,48.39 69.34,49.02 26.8,49.02 21.95,44.17 21.95,30.52 22.77,29.69 v1(22.77,27.43) ; v1(72.52,11.12) 70.23,8.84 70.23,2.41 68.83,1.02 27.56,1.02 22.86,5.72 22.86,19.22 v1(22.38,19.7)
  Bottom Layer w0.28: U19.5 22.86,27.23 22.71,27.38 22.73,27.38 v1(22.77,27.43) ; v1(22.38,19.7) 22.38,19.73 22.86,20.22 U19.26
  vias: v1(70.99,43.43) v1(70.99,21.71) v1(70.99,15.88) v1(71.03,34.16) v1(71.03,28.32) v1(71.03,6.47) v1(73.03,43.43) v1(73.03,21.71) v1(73.03,15.88) v1(73.06,34.16) v1(73.06,28.32) v1(73.06,6.47) v1(75.06,43.43) v1(75.1,34.16) v1(75.1,28.32) v1(75.06,21.71) v1(75.06,15.88) v1(75.1,6.47) v1(77.09,43.43) v1(77.13,34.16) v1(77.09,15.88) v1(77.13,6.47) v1(78.11,26.29) v1(78.11,23.49) v1(79.12,43.43) v1(79.12,21.71) v1(79.12,15.88) v1(79.16,34.16) v1(79.16,28.32) v1(79.16,6.47) v1(80.26,26.29) v1(80.26,23.49) v1(81.32,28.32) v1(81.28,21.71) v1(82.42,26.29) v1(82.42,23.49) v1(83.48,28.32) v1(83.44,21.71) v1(84.58,26.29) v1(84.58,23.49) v1(85.6,21.71) v1(85.64,28.32)
VOUTS: length 5.6
  Top Layer w0.254: RN2.2 15.01,32.24 14.35,32.89 14.35,34.4 v1(14.08,34.67)
  Bottom Layer w0.254: v1(14.08,34.67) 14.08,34.62 13.42,34.62 13.37,34.67 ; R61.1 R60.2
$1N920: length 1.6
  Bottom Layer w0.28: U19.15 25.66,23.87 25.42,23.63 25.4,23.63 ; 25.4,23.63 v1(25.3,23.63) ; 25.4,23.63 25.65,23.37 U19.16
$1N1636: length 19
  Inner2 w0.254: v1(18.34,27.05) 18.34,25.25 17.13,24.04 17.13,22.87 17.78,22.21 17.78,19.81 18.29,19.3 18.32,19.3 18.43,19.2 18.91,19.2 19.01,19.3 19.99,19.3 20.28,19.59 v1(20.45,19.59)
  Bottom Layer w0.254: v1(18.34,27.05) 18.4,26.99 18.4,26.53 ; 18.4,26.53 U19.1 ; 18.4,26.53 18.33,26.6 18.03,26.6 17.77,26.34 17.28,26.34 17.02,26.6 C7.1 ; U19.30 20.86,19.97 20.85,19.96 20.81,19.96 v1(20.45,19.59)
$1N1751: length 1.5
  Bottom Layer w0.254: 18.79,24.64 19.05,24.37 U19.37
$1N1787: length 5.1
  Bottom Layer w0.254: v1(21.01,24.05) 21.01,24.07 20.88,24.2 20.88,24.55 20.55,24.87 U19.38 ; 19.84,22.87 18.69,22.87 R6.2
  Bottom Layer w0.28: 19.84,22.87 19.47,23.24 19.47,23.69 19.67,23.89 20.19,23.89 U19.36 20.57,23.87 20.89,24.19
$1N4968: length 14.2
  Top Layer w0.254: Q10.4 v1(39.5,33.5)
  Bottom Layer w0.28: 28.19,31.11 28.96,31.11 31.24,33.4 32.45,33.4 ; 32.45,33.4 39.4,33.4 v1(39.5,33.5) ; 32.45,33.4 32.51,33.46 R48.1
$1N4976: length 3.1
  Top Layer w0.28: v1(29.97,26.39) 31.04,26.39 Q11.5
  Bottom Layer w0.28: 28.57,25.4 28.98,25.4 v1(29.97,26.39)
$1N5499: length 3.3
  Top Layer w0.28: v1(24.62,21.52) 24.87,21.27 D5.1
  Bottom Layer w0.28: C8.1 26.42,21.37 U19.20 25.99,21.4 24.74,21.4 v1(24.62,21.52)
$1N5574: length 3.9
  Top Layer w0.254: D6.1 24.62,26.53 v1(24.62,25.73)
  Bottom Layer w0.28: 24.51,25.65 24.7,25.84 25.54,25.84 25.57,25.87 U19.11 26.72,25.87 C10.2
$1N7681: length 1.6
  Bottom Layer w0.28: R43.2 17.73,8.96 U9.4
$1N7684: length 2.3
  Bottom Layer w0.28: 9.78,14.8 9.84,14.8 10.67,13.97 U9.8
  vias: v1(10.8,14.73) v1(11.56,14.73) v1(12.32,14.73)
$1N7685: length 2.2
  Bottom Layer w0.28: 9.78,13.4 10.35,13.4 10.92,12.83 11.61,12.83 11.73,12.7
$1N7687: length 5.4
  Bottom Layer w0.28: R45.2 12.21,9.69 U9.5 10.51,10.16 C45.1 9.88,10.69 R46.1
$1N8268: length 8
  Top Layer w0.28: 34.54,16.36 34.52,16.38 v1(33.78,16.38)
  Bottom Layer w0.254: 32.84,16.51 32.89,16.46 R52.1
  Bottom Layer w0.28: 27.46,17.12 28.09,17.12 28.7,16.51 33.66,16.51 v1(33.78,16.38)
$1N8274: length 2.9
  Top Layer w0.28: v1(29.97,18.54) 30.85,18.54 Q13.5
  Bottom Layer w0.28: R51.1 31.12,18.88 R50.2
$1N24788: length 20
  Top Layer w0.28: v1(21.01,22.62) 21.01,22.75 20.71,23.05 20.71,23.38 20.51,23.58 ; 19.69,26.92 20.39,26.23 20.39,23.7 20.51,23.58 ; 20.51,23.58 20.39,23.47 20.39,21.02 R58.1
  Inner2 w0.254: v1(21.01,22.62) 20.27,23.36 20.27,30.94 v1(20.32,30.99)
  Bottom Layer w0.254: v1(20.32,30.99) 20.57,31.24 22.71,31.24 U24.8
$1N24792: length 14.2
  Top Layer w0.28: v1(18.88,23.73) 19.59,23.73 19.69,23.62 ; 19.69,23.62 R56.1 ; 19.69,23.62 19.69,25.53
  Inner2 w0.254: v1(18.88,23.73) 19.28,24.13 19.28,29.57 19.69,29.97 v1(19.69,30.23)
  Bottom Layer w0.254: v1(19.69,30.23) 18.92,30.99 U24.1
$1N25603: length 9.3
  Top Layer w0.254: U13.5 6.62,33.38 7.37,32.64 11.07,32.64 C99.2 12.28,33.04 RN2.6
$1N25604: length 9.4
  Top Layer w0.254: U13.7 7.11,30.2 7.11,30.99 7.62,31.5 8.64,31.5 9.09,31.04 9.09,30.11 9.74,29.46 10.99,29.46 11.75,30.23 ; C95.2 13.09,31.44 RN2.8
$1N25605: length 9.1
  Top Layer w0.254: RN2.7 12.28,32.24 C96.2 11.72,31.83 10.99,31.11 9.71,31.11 8.81,32 7.37,32 6.62,31.26 U13.6
$1N25606: length 9.2
  Top Layer w0.254: U13.4 7.11,35.08 7.11,33.78 7.75,33.15 8.51,33.15 9.69,34.32 10.99,34.32 11.72,35.05 C98.2 12.24,35.05 RN2.5
$1N32854:
  vias: v1(4.7,14.86) v1(5.46,15.11)
$1N32855: length 1.4
  Bottom Layer w0.508: 4.38,13.71 4.2,13.52 3.05,13.52
$1N32858: length 1.4
  Bottom Layer w0.254: 5.85,9.4 5.84,9.41 R19.1
$1N32864: length 3.3
  Bottom Layer w0.254: 6.28,13.71 6.28,12.88 5.72,12.31 ; 5.72,12.31 R19.2 ; 5.72,12.31 R18.1
$1N33061: length 1.6
  Bottom Layer w0.254: R61.2 11.77,36.7 11.77,37.97
$1N33196: length 1.8
  Bottom Layer w0.254: R65.1 R64.2
$1N37380: length 1.2
  Bottom Layer w0.254: C113.2 19.5,29.15 R67.2

## Copper pours and planes (outline as drawn; the poured copper is in the pictures)
12V on Top Layer: 16.13,11.81 16.13,17.27 16.51,17.65 18.54,17.65 18.54,14.73 18.03,14.22 17.53,14.22 17.53,13.21
12V on Bottom Layer: 18.54,17.65 16.51,17.65 16.13,17.27 16.13,14.86 18.54,14.86
12V on Bottom Layer: 5.72,18.8 8.64,18.8 8.64,15.37 5.72,15.37
+5V on Top Layer: 7.69,21.34 9.73,21.34 9.73,12.83 7.69,12.83
GND on Top Layer: 29.79,31.2 33.15,31.2 33.15,19.69 29.79,19.69
GND on Top Layer: 70.55,5.52 76.01,5.52 76.01,3.11 70.55,3.11
GND on Top Layer: 9.89,21.34 11.56,21.34 11.56,16.64 9.89,16.64
GND on Top Layer: 24.64,34.67 33.15,34.67 33.15,31.11 24.64,31.11
GND on Top Layer: 70.49,46.86 75.95,46.86 75.95,44.45 70.49,44.45
GND on Top Layer: 24.57,9.02 33.97,9.02 33.97,7.75 34.23,7.49 40.2,7.49 40.2,4.44 33.72,4.44 33.72,4.45 24.57,4.45
GND on Top Layer: 24.64,20.07 33.15,20.07 33.15,15.11 24.64,15.11
GND on Top Layer: 70.45,20.83 80.1,20.83 80.1,16.76 70.45,16.76
GND on Top Layer: 24.64,40.77 34.04,40.77 34.04,42.04 34.29,42.29 40.26,42.29 40.26,45.34 33.78,45.34 33.78,45.34 24.64,45.34
GND on Top Layer: 70.49,33.27 80.14,33.27 80.14,29.21 70.49,29.21
GND on Bottom Layer: 24.51,7.3 40.51,7.3 40.51,-1.08 24.51,-1.08
GND on Bottom Layer: 40.51,50.67 95.12,50.67 95.12,-1.4 40.51,-1.4
GND on Bottom Layer: 3.05,7.24 25.02,7.24 25.02,-1.02 3.05,-1.02
GND on Bottom Layer: 3.43,18.54 23.62,18.54 23.62,7.89 3.43,7.89
GND on Bottom Layer: 24.89,50.8 40.89,50.8 40.89,42.55 24.89,42.55
GND on Bottom Layer: 7.43,51.05 26.35,51.05 26.35,42.67 7.43,42.67
GND on Bottom Layer: 24.26,34.67 40.64,34.67 40.64,15.11 24.26,15.11
GND on Bottom Layer: 3.56,36.07 9.78,36.07 10.41,35.43 12.19,35.43 12.19,34.04 13.97,32.26 13.97,29.03 14.29,28.72 16.02,28.72 16.26,28.96 17.91,28.96 18.54,29.59 18.59,29.59 18.92,29.93 21.42,29.93 22,30.51 23.72,30.51 23.75,30.48 23.75,27.81 23.5,27.56 19.94,27.56 19.56,27.18 19.56,22.91 19.52,22.87 19.52,20.5 19.69,20.32 18.82,19.44 18.82,19.3 3.94,19.3 3.81,19.43 3.81,35.81
GND on Inner1: 22.74,23.61 22.74,22.99 18.55,18.8 2.29,18.8 2.16,18.92 2.16,23.88 22.48,23.88
GND on Inner1: 24.26,51.44 90.55,51.44 90.55,-1.14 24.26,-1.14
GND on Inner1: 24.38,24.51 23.11,24.51 22.99,24.38 22.99,22.86 18.54,18.41 3.43,18.41 3.43,10.41 23.88,10.41 23.88,21.34 24.38,21.84
GND on Inner1: 2.16,39.37 22.73,39.37 22.73,23.37 2.16,23.37
GND on Inner1: 7.43,51.75 25.21,51.75 25.21,40.45 7.43,40.45
GND on Inner1: 3.05,9.78 26.03,9.78 26.03,-1.27 3.05,-1.27
GND on Inner2: 0,18.41 20.7,18.41 20.96,18.16 20.96,9.02 0,9.02
GND on Inner2: 0,21.08 3.6,21.08 3.6,17.76 0,17.76
VCC on Top Layer: 24.64,40.51 39.75,40.51 39.75,34.92 24.64,34.92
VCC on Top Layer: 20.32,30.1 24.89,30.1 24.89,27.56 20.32,27.56
VCC on Top Layer: 24.38,30.86 29.46,30.86 29.46,20.32 24.38,20.32
VCC on Top Layer: 39.69,9.4 24.57,9.4 24.57,14.86 39.69,14.86
VCC on Top Layer: 7.43,50.36 7.43,38.67 20,38.67 23.69,34.99 24.7,34.99 24.7,40.45 24.07,41.08 24.07,50.36
VCC on Top Layer: 3.18,-0.51 3.18,11.18 18.29,11.18 21.97,14.86 24.64,14.86 24.64,9.4 24,8.76 24,-0.51
VCC on Bottom Layer: 24.45,14.86 40.32,14.86 40.32,7.49 24.45,7.49
VCC on Bottom Layer: 24.38,42.42 40.26,42.42 40.26,35.05 24.38,35.05
VCC on Bottom Layer: 16.76,13.08 18.54,13.08 18.92,12.7 23.5,12.7 23.5,10.92 17.02,10.92 16.76,11.18
VCC on Inner1: 35.43,14.86 38.74,14.86 38.74,11.05 35.43,11.05
VCC on Inner1: 35.43,38.86 38.74,38.86 38.74,35.05 35.43,35.05
VCC on Inner2: 24.26,41.91 50.55,41.91 50.55,8 24.26,8
VIN on Top Layer: 14.42,38.39 19.78,38.39 21.84,36.32 21.84,34.29 19.81,34.29 18.8,35.31 14.42,35.31
VIN on Bottom Layer: 15.05,38.3 17.01,40.26 23.88,40.26 23.88,35.69 15.05,35.69
CS1 on Top Layer: 60.07,23.24 58.8,21.97 58.8,4.17 60.05,2.92 69.47,2.92 69.47,23.24
CS2 on Top Layer: 60.2,47.75 58.93,46.48 58.93,27.32 60.3,25.91 69.47,25.91 69.47,47.75
SW1 on Top Layer: 33.59,24.38 49.47,24.38 50.23,23.62 50.23,3.43 48.96,2.16 41.97,2.16 40.7,3.43 40.7,14.99 40.2,15.49 33.59,15.49
SW1 on Bottom Layer: 33.59,23.37 49.34,23.37 50.23,22.48 50.23,3.43 49.47,2.67 41.47,2.67 40.7,3.43 40.7,14.99 40.2,15.49 33.59,15.49
SW1 on Inner1: 33.91,19.81 39.37,19.81 39.37,17.02 33.91,17.02
SW2 on Top Layer: 33.53,25.53 49.4,25.53 50.17,26.29 50.17,46.48 48.9,47.75 41.91,47.75 40.64,46.48 40.64,34.92 40.13,34.42 33.53,34.42
SW2 on Bottom Layer: 33.53,26.54 49.28,26.54 50.17,27.43 50.17,46.48 49.4,47.24 41.4,47.24 40.64,46.48 40.64,34.92 40.13,34.42 33.53,34.42
SW2 on Inner1: 33.91,32.89 39.37,32.89 39.37,30.1 33.91,30.1
VOUT on Top Layer: 70.49,44.07 77.47,44.07 77.47,33.53 70.49,33.53
VOUT on Top Layer: 70.49,28.96 76.07,28.96 76.07,20.95 70.49,20.95
VOUT on Top Layer: 70.49,51.05 91.44,51.05 91.44,-0.25 70.49,-0.25
VOUT on Bottom Layer: 69.09,8.96 80.14,8.96 80.14,5.78 69.09,5.78
VOUT on Bottom Layer: 69.09,16.38 80.14,16.38 80.14,13.21 69.09,13.21
VOUT on Bottom Layer: 69.09,36.64 80.14,36.64 80.14,33.47 69.09,33.47
VOUT on Bottom Layer: 80.39,31.24 87,31.24 87,28.7 80.39,28.7
VOUT on Bottom Layer: 69.09,43.94 80.14,43.94 80.14,40.77 69.09,40.77
VOUT on Bottom Layer: 69.09,28.7 87,28.7 87,21.21 69.09,21.21
VOUT on Bottom Layer: 80.39,21.21 87,21.21 87,18.67 80.39,18.67
VOUT on Inner2: 70.1,49.4 91.57,49.4 91.57,0.38 70.1,0.38
$1N7684 on Bottom Layer: 9.27,14.22 10.03,14.22 11.05,13.21 12.71,13.21 12.71,15.61 12.7,15.62 9.27,15.62
$1N32854 on Top Layer: 3.56,15.49 5.84,15.49 5.84,12.7 3.56,12.7
$1N32854 on Bottom Layer: 2.67,16.64 5.84,16.64 5.84,14.48 2.67,14.48
